# EAGLE design untitled2 (EAGLE 7.2.0)
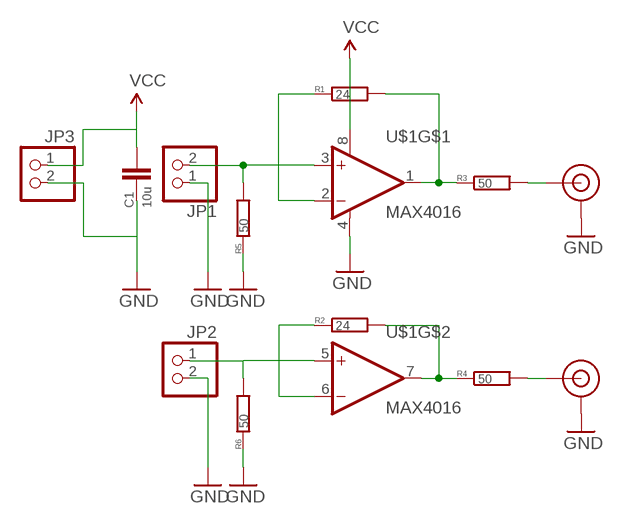
[diagram p0: schematic, sheet 1]

## Parts
C1  10u  CC0805  [C0805]
J$1  SMA_EDGE  [SMA-EDGE]
J$2  SMA_EDGE  [SMA-EDGE]
JP1  PINHD-1X02_2.54  [1X02]
JP2  PINHD-1X02_2.54  [1X02]
JP3  PINHD-1X02_2.54  [1X02]
R1  24  R0603  [0603]
R2  24  R0603  [0603]
R3  50  R0603  [0603]
R4  50  R0603  [0603]
R5  50  R0603  [0603]
R6  50  R0603  [0603]
U$1  MAX4016  [SO08]

## Nets
GND: C1.2 J$1.GND@0(GND) J$1.GND@1(GND) J$1.GND@2(GND) J$1.GND@3(GND) J$2.GND@0(GND) J$2.GND@1(GND) J$2.GND@2(GND) J$2.GND@3(GND) JP1.1 JP2.2 JP3.2 R5.1 R6.1 U$1.4(V-)
N$1: R1.2 R3.1 U$1.1(OUT)
N$2: R2.2 R4.1 U$1.7(OUT)
N$4: J$2.SIG(SIGNAL) R4.2
N$5: J$1.SIG(SIGNAL) R3.2
N$7: R1.1 U$1.2(-IN)
N$8: R2.1 U$1.6(-IN)
N$9: JP2.1 R6.2 U$1.5(+IN)
N$10: JP1.2 R5.2 U$1.3(+IN)
VCC: C1.1 JP3.1 U$1.8(V+)

## Library data of the parts
C1 = smalsmd:C: Capacitor
J$1 J$2 = SparkFun-Connectors:SMA_EDGE: SMA Antenna Connector End launch SMA connector. The paste layer has been removed so that the connector can be hand soldered onto the board after reflow.
JP1-JP3 = pinhead-2:PINHD-1X02: PIN HEADER
R1-R6 = smalsmd:R
U$1 = OU:MAX4016

## Board
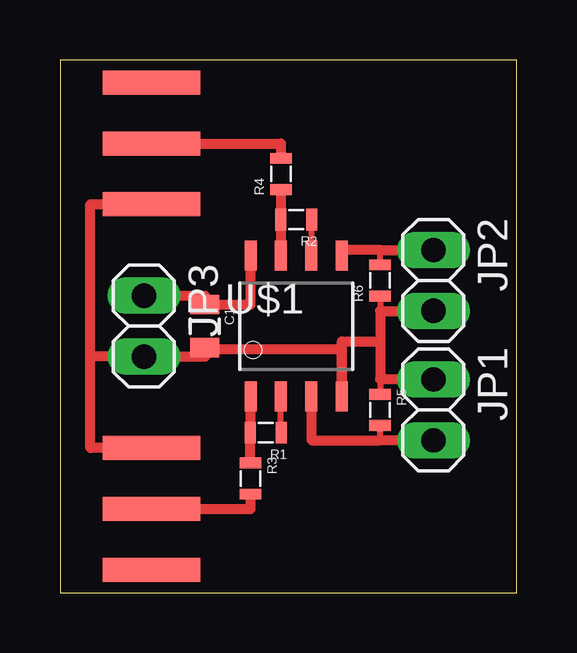
[diagram p1: board, top side]
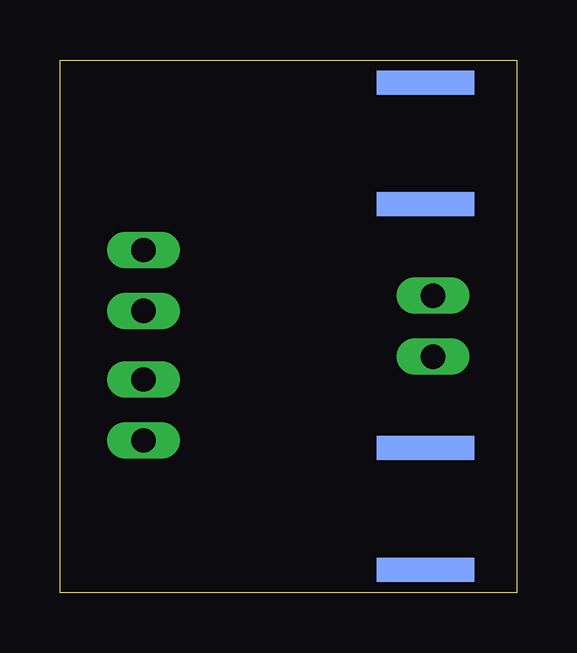
[diagram p2: board, bottom side, seen from below]

Size 19.03 x 22.21 mm. Coordinates in mm from the lower left corner, seen from the top.
Outline: 0,0 19.03,0 19.03,22.21 0,22.21 0,0
Copper layers (1*16): Top 0.035mm / dielectric 1.5mm / Bottom 0.035mm
Design rules "default": minimum track width 0.2mm, minimum drill 0.2mm, track to track 0.2mm, track to pad 0.2mm, pad to pad 0.2mm, via to via 0.2mm, smd to smd 0.2mm, copper to edge 0.2mm, drill to drill 0.2mm, minimum pad ring 10mil, minimum via ring 8mil, stop-mask expansion 4mil, vias tented up to drill 0mil, thermal gap 10mil

### Footprints (pad centres in the part's own frame; a part is rotated, then mirrored left to right if it is on the bottom)
C0805 = smd 0.8 x 1.2: 1 -0.9,0; 2 0.9,0
SMA-EDGE = smd 1 x 4.064: GND@0 0,0; GND@1 5.08,0; SIG 2.54,0 | smd 1 x 4.064 bottom: GND@2 0,0; GND@3 5.08,0
1X02 = drill 1.016 long: 1 -1.27,0; 2 1.27,0
0603 = smd 0.45 x 0.9: 1 -0.65,0; 2 0.65,0
SO08 = smd 0.5 x 1.25: 1 -1.905,-2.934; 2 -0.635,-2.934; 3 0.635,-2.934; 4 1.905,-2.934; 5 1.905,2.934; 6 0.635,2.934; 7 -0.635,2.934; 8 -1.905,2.934

### Placement (x,y rotation side)
C1  6.03,11.11 270 top
J$1  3.81,0.95 90 top
J$2  3.81,16.19 90 top
JP1  15.56,7.62 270 top
JP2  15.56,13.02 270 top
JP3  3.49,11.11 270 top
R1  8.57,6.67 180 top
R2  9.84,15.56 180 top
R3  7.94,4.76 270 top
R4  9.21,17.46 90 top
R5  13.34,7.62 270 top
R6  13.34,13.02 90 top
U$1  9.84,11.11 0 top

### Tracks (layer width: path | path; a pad name or v marks a point on that pad's centre or on a via)
GND
  Top 0.254: R6.1 13.34,11.75 | 13.34,8.89 R5.1
  Top 0.406: 6.03,10.16 C1.2 | J$1.GND@1 1.27,6.03 1.27,9.84 | 1.27,9.84 1.27,16.19 J$2.GND@0 | 1.27,9.84 JP3.2 6.03,9.84 6.03,10.16 | 6.03,10.16 11.75,10.16 U$1.4 11.75,10.48 13.34,10.48 | JP2.2 13.34,11.75 13.34,10.48 | 13.34,10.48 13.34,8.89 JP1.1
N$1
  Top 0.254: R1.2 7.94,6.67 | R3.1 7.92,5.41
  Top 0.406: 7.94,6.67 U$1.1 | 7.92,5.41 R1.2
N$2
  Top 0.254: R4.1 9.19,16.81 | R2.2 9.21,15.56
  Top 0.406: 9.19,16.81 R2.2 | 9.21,15.56 U$1.7
N$4
  Top 0.406: J$2.SIG 9.21,18.73 R4.2
N$5
  Top 0.406: J$1.SIG 7.94,3.49 R3.2
N$7
  Top 0.254: R1.1 9.21,6.67 U$1.2
N$8
  Top 0.254: R2.1 10.48,15.56 U$1.6
N$9
  Top 0.254: 11.73,14.05 U$1.5 11.75,14.29 | R6.2 13.34,14.29
  Top 0.406: 11.75,14.29 13.34,14.29 JP2.1
N$10
  Top 0.254: 13.34,6.35 R5.2
  Top 0.406: JP1.2 13.34,6.35 10.48,6.35 U$1.3
VCC
  Top 0.406: JP3.1 6.03,12.38 C1.1 7.94,12.01 U$1.8